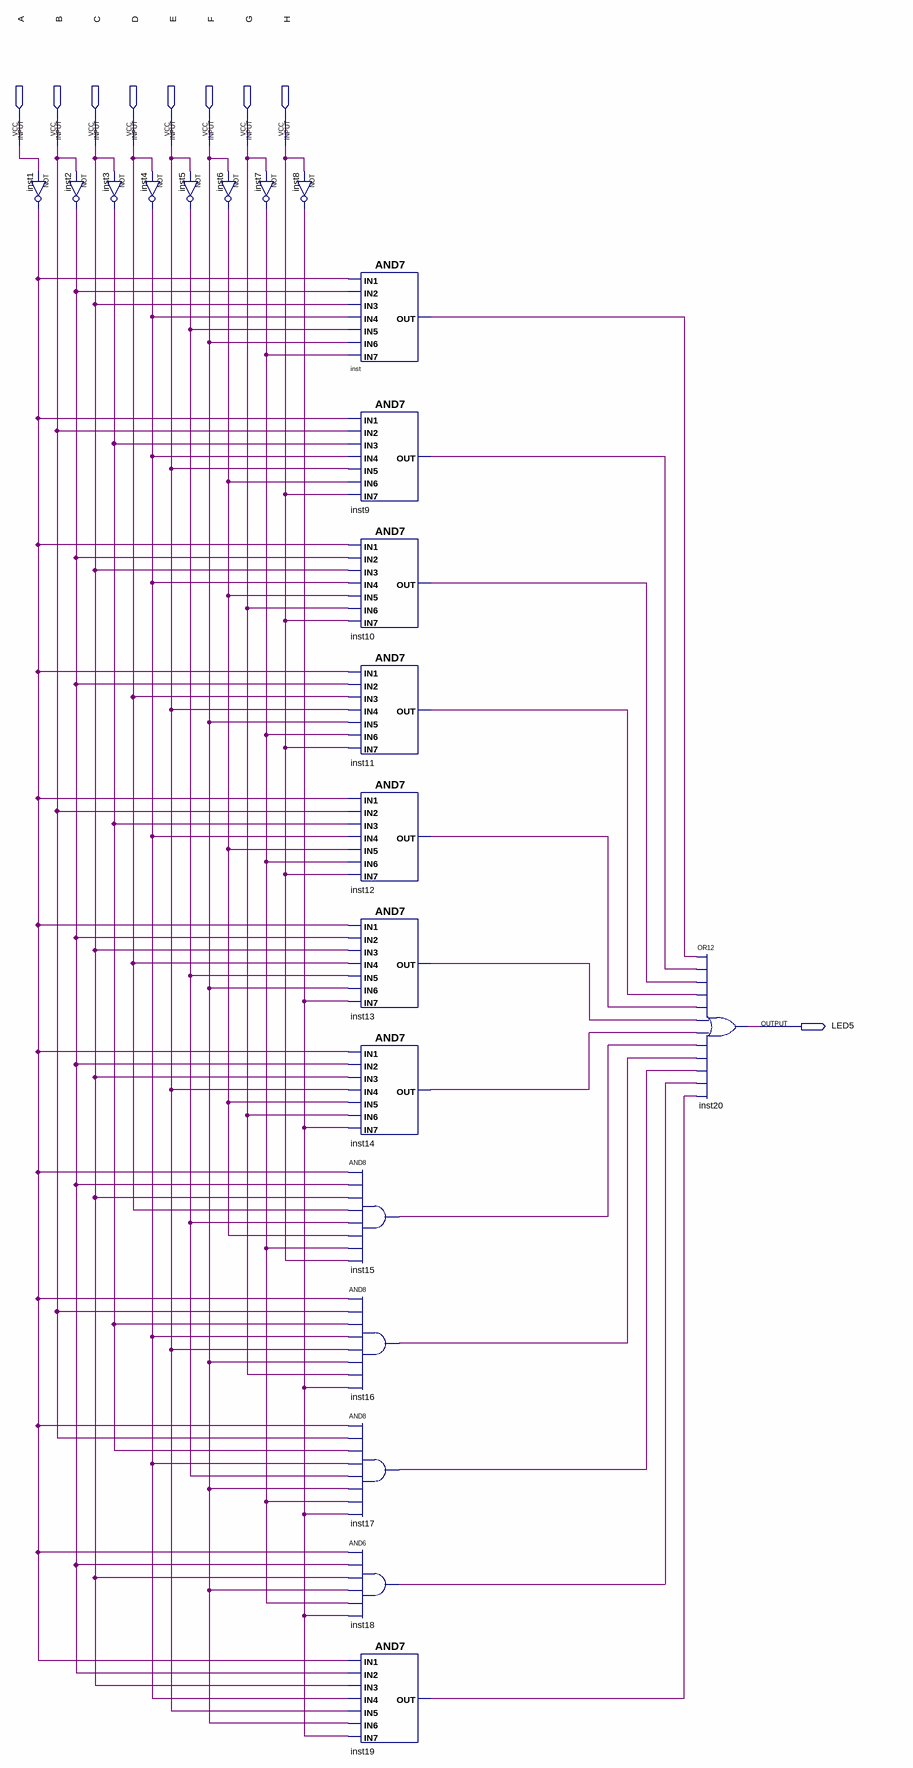
[diagram p0: schematic sheet]
// Quartus schematic LED5.bdf as structural Verilog: 21 symbols, 9 pins
module LED5 (
  input  A,
  input  B,
  input  C,
  input  D,
  input  E,
  input  F,
  input  G,
  input  H,
  output LED5
);

  wire inst1_out, inst2_out, inst3_out, inst4_out, inst5_out, inst6_out, inst7_out, inst8_out, inst9_out,
       inst10_out, inst11_out, inst12_out, inst13_out, inst14_out, inst15_out, inst16_out, inst17_out,
       inst18_out, inst19_out, inst_out;

  not inst1 (inst1_out, A);
  not inst2 (inst2_out, B);
  not inst3 (inst3_out, C);
  not inst4 (inst4_out, D);
  not inst5 (inst5_out, E);
  not inst6 (inst6_out, F);
  not inst7 (inst7_out, G);
  not inst8 (inst8_out, H);
  and inst (inst_out, inst1_out, inst2_out, C, inst4_out, inst5_out, F, inst7_out);
  and inst9 (inst9_out, inst1_out, B, inst3_out, inst4_out, E, inst6_out, H);
  and inst10 (inst10_out, inst1_out, inst2_out, C, inst4_out, inst6_out, G, H);
  and inst11 (inst11_out, inst1_out, inst2_out, D, E, F, inst7_out, H);
  and inst12 (inst12_out, inst1_out, B, inst3_out, inst4_out, inst6_out, inst7_out, H);
  and inst13 (inst13_out, inst1_out, inst2_out, C, D, inst5_out, F, inst8_out);
  and inst14 (inst14_out, inst1_out, inst2_out, C, E, inst6_out, G, inst8_out);
  and inst15 (inst15_out, inst1_out, inst2_out, C, D, inst5_out, inst6_out, inst7_out, H);
  and inst16 (inst16_out, inst1_out, B, inst3_out, inst4_out, E, F, G, inst8_out);
  and inst17 (inst17_out, inst1_out, B, inst3_out, inst4_out, inst5_out, F, inst7_out, inst8_out);
  and inst18 (inst18_out, inst1_out, inst2_out, C, F, inst7_out, inst8_out);
  and inst19 (inst19_out, inst1_out, inst2_out, C, inst4_out, E, F, inst8_out);
  or inst20 (LED5, inst_out, inst9_out, inst10_out, inst11_out, inst12_out, inst13_out, inst14_out, inst15_out, inst16_out, inst17_out, inst18_out, inst19_out);
endmodule
